# EAGLE design C3D ReMix Expansion - RJ45 Hat (EAGLE 6.4)
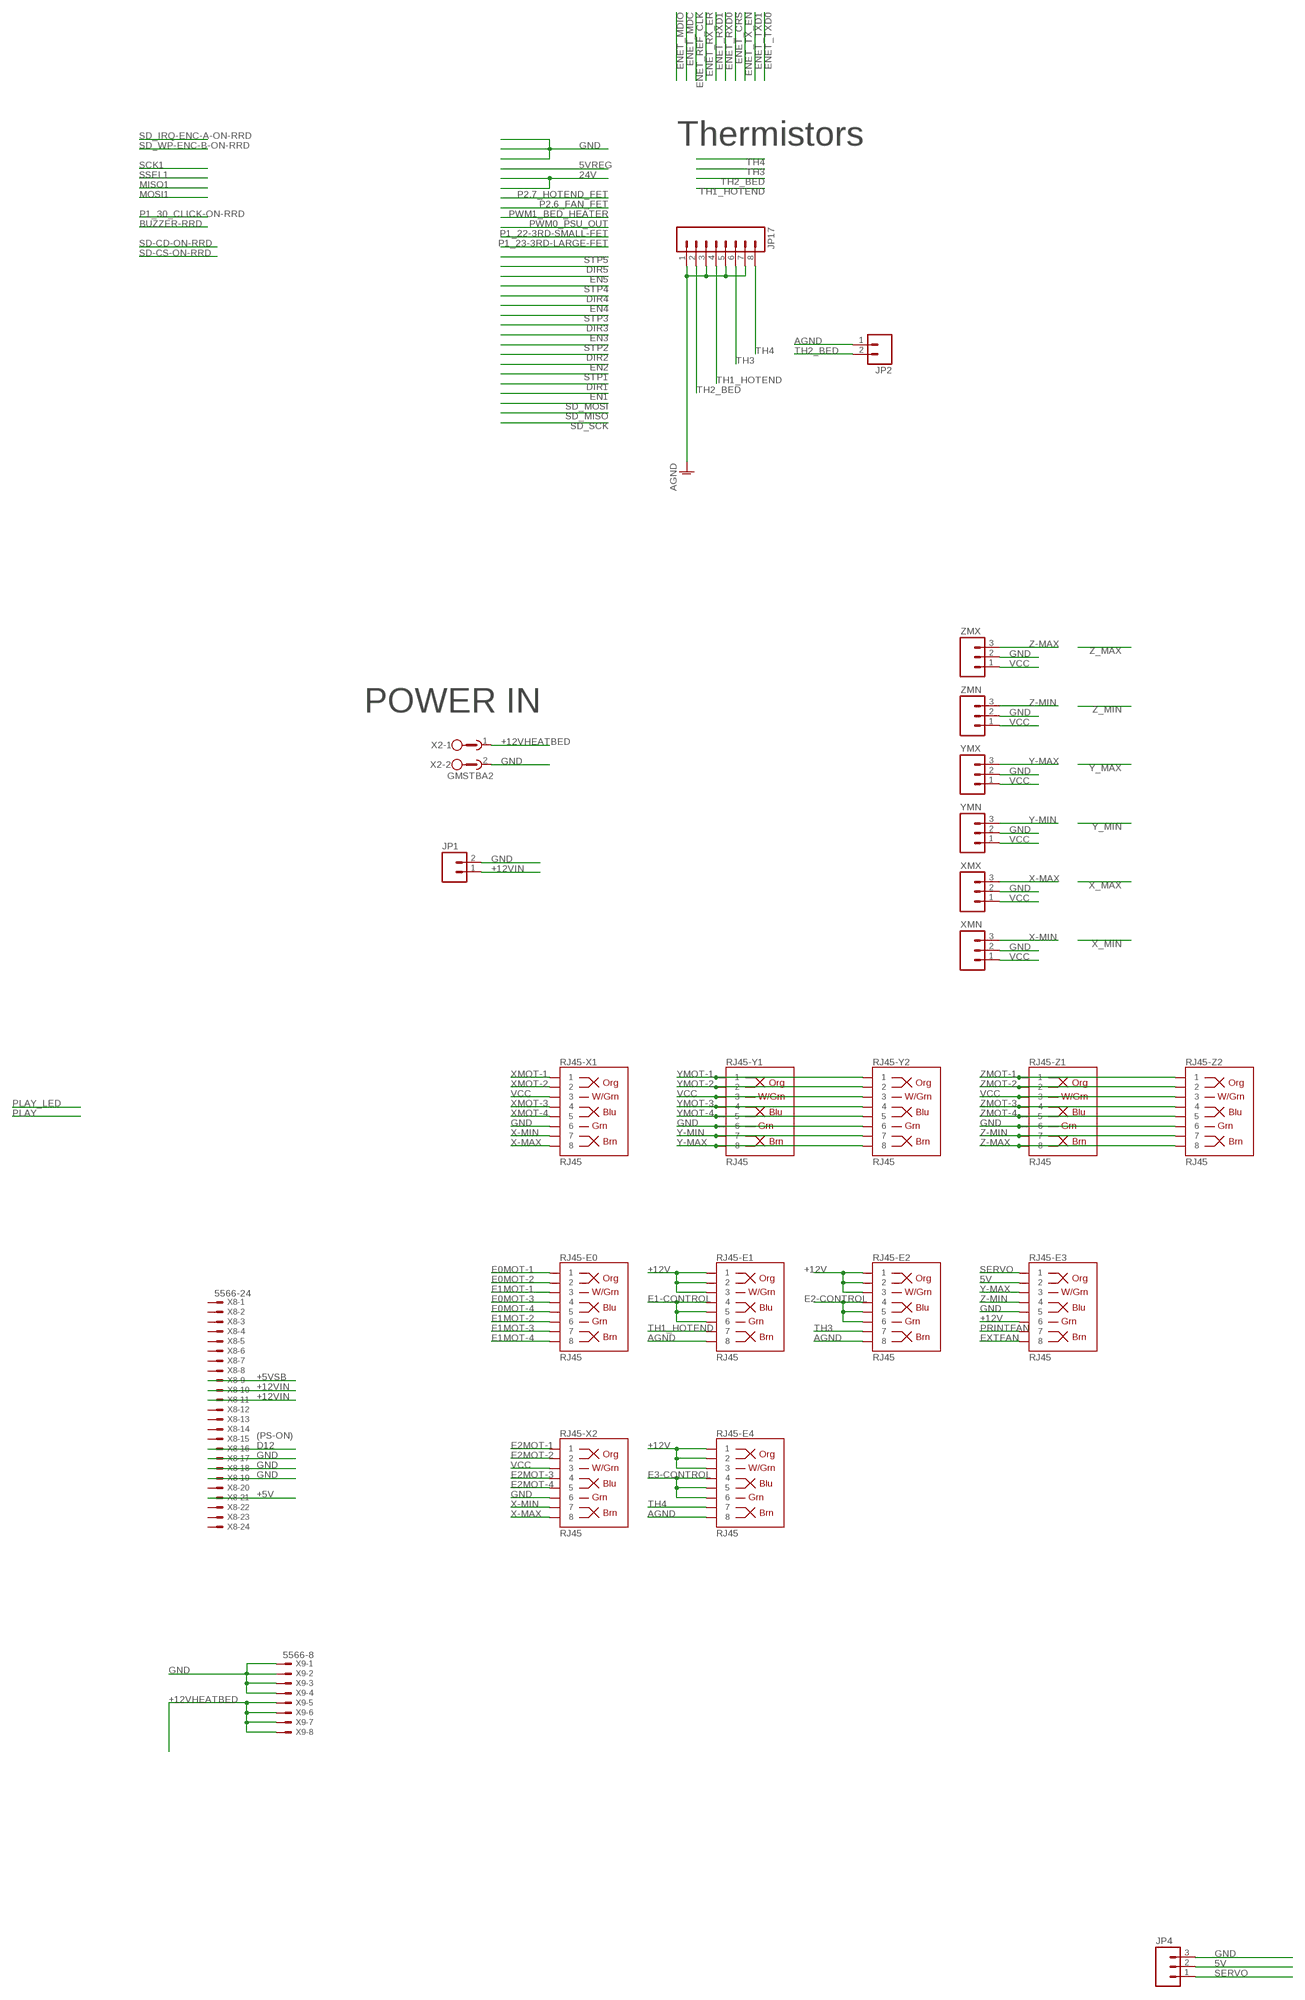
[diagram p0: schematic, sheet 1, part 1 of 2]
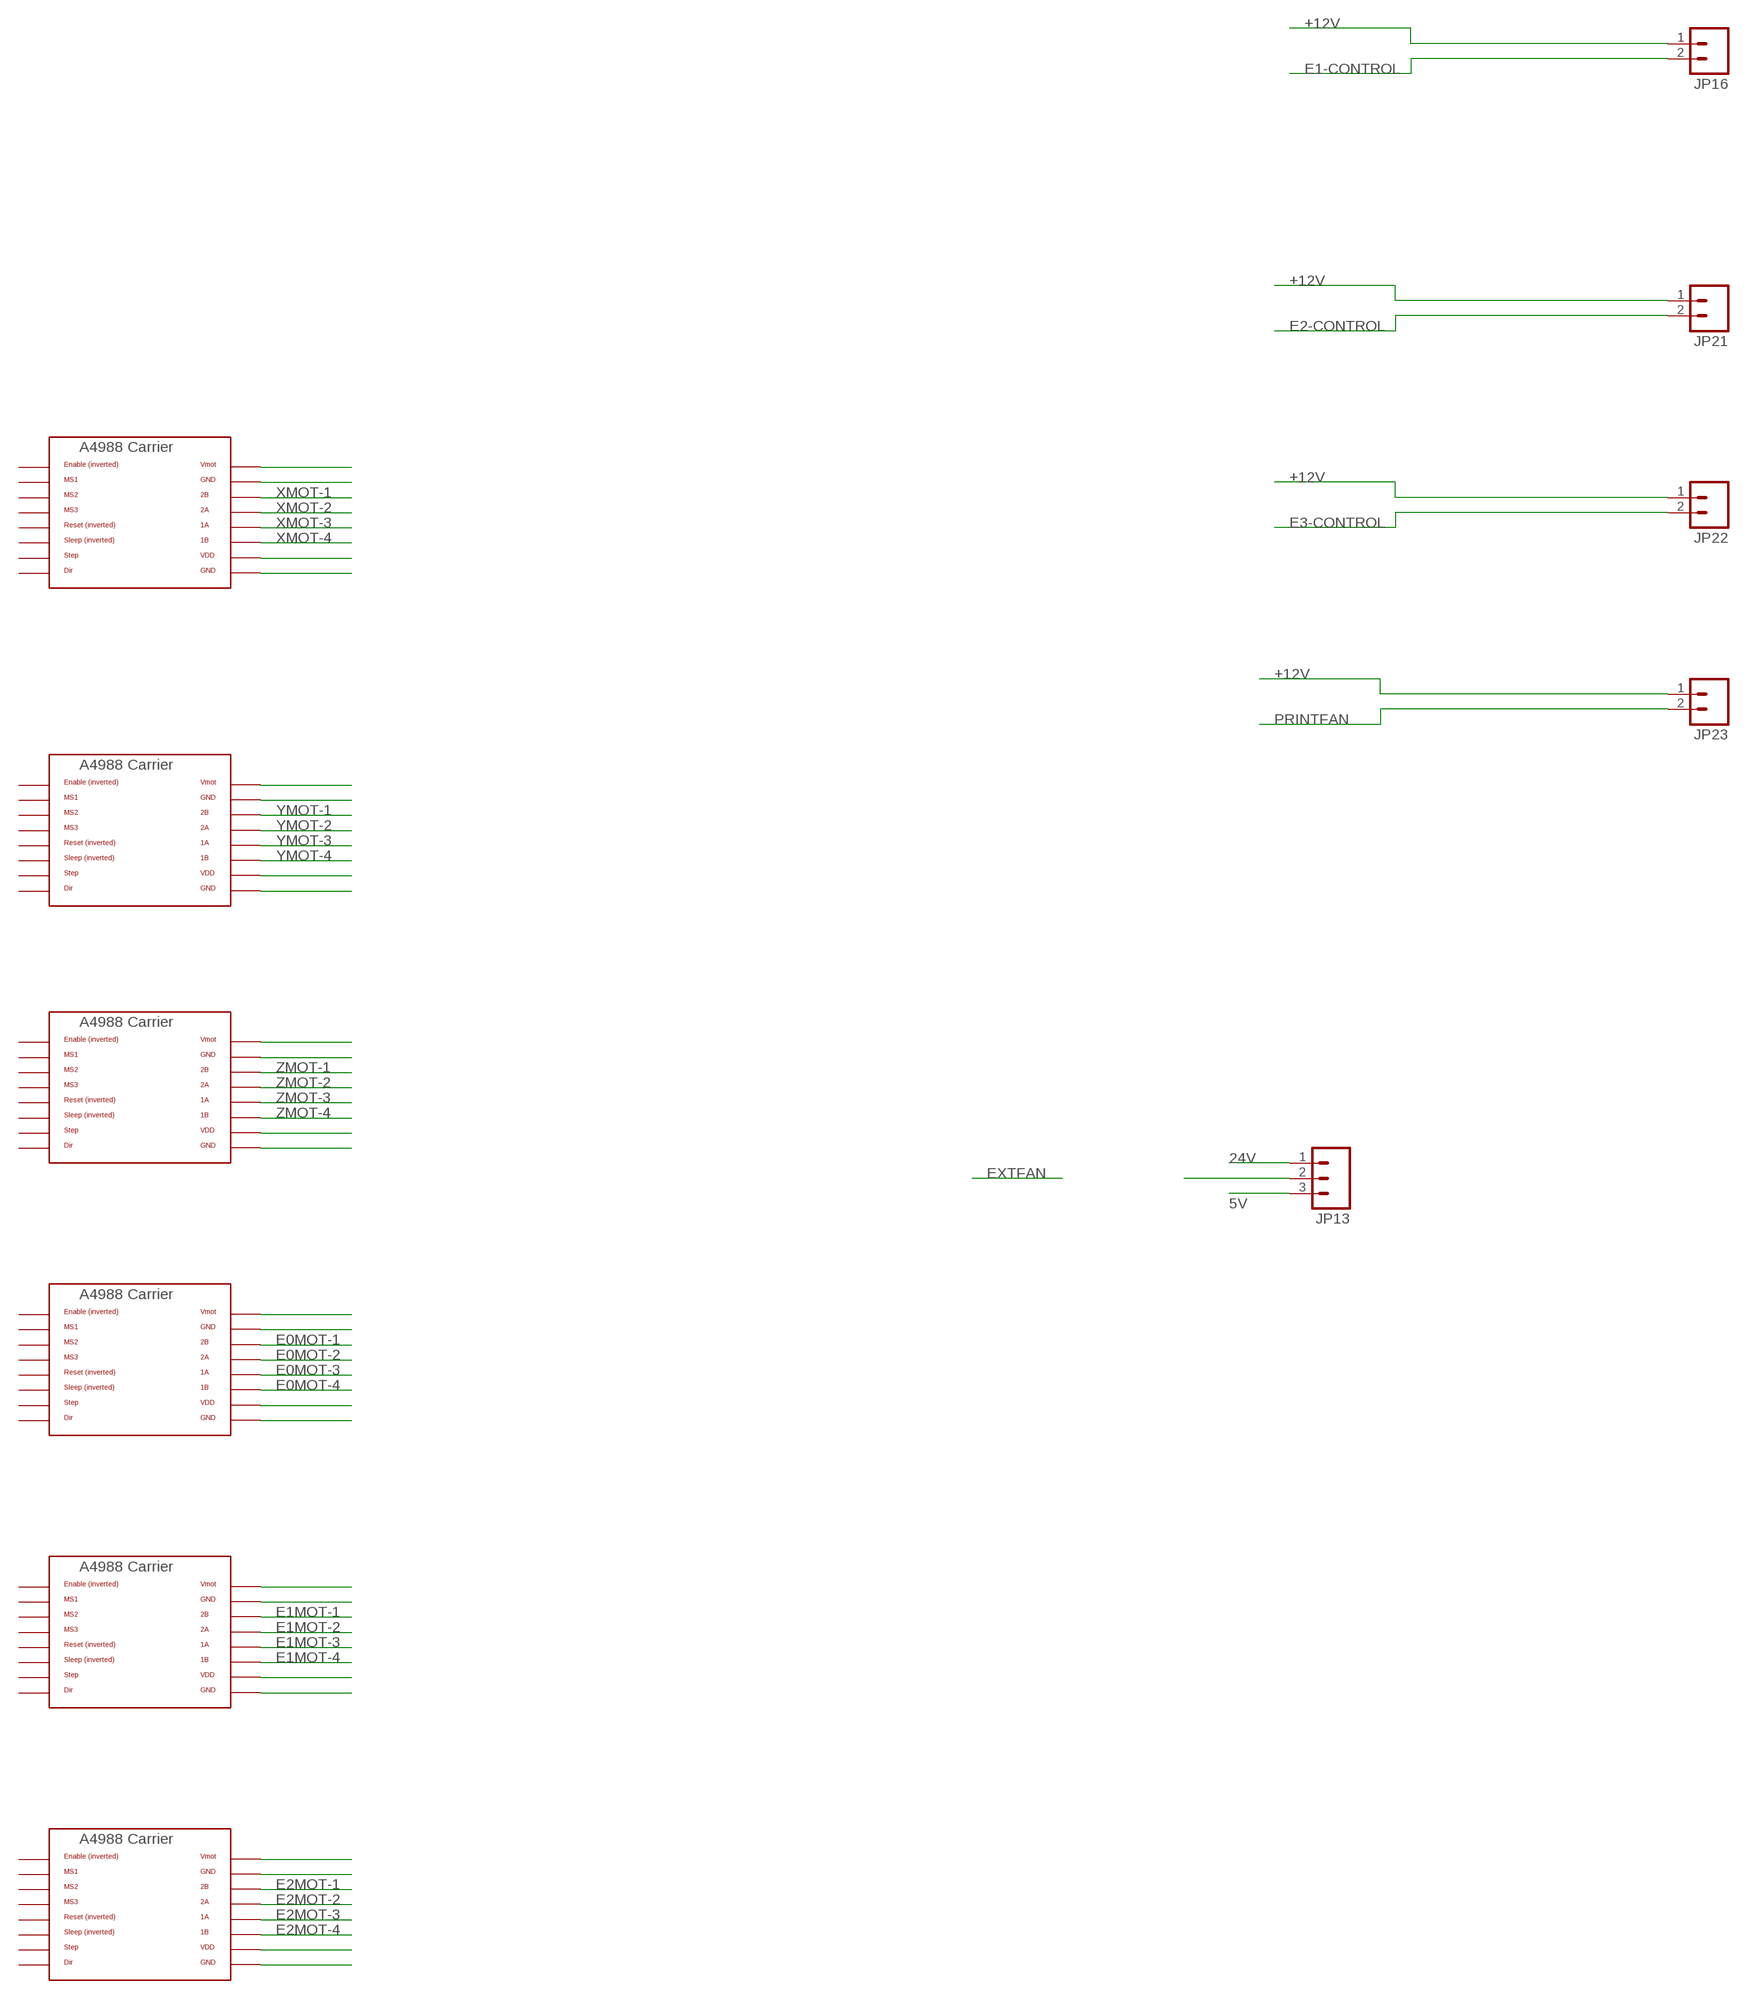
[diagram p1: schematic, sheet 1, part 2 of 2]

## Parts
JP1  M025MM  [SCREWTERMINAL-5MM-2]
JP2  M02LOCK  [1X02_LOCK]
JP4  M03LOCK  [1X03_LOCK]
JP13  M03LOCK_NO_SILK  [1X03_LOCK_NO_SILK]
JP16  M02LOCK  [1X02_LOCK]
JP17  M08LOCK  [1X08_LOCK]
JP21  M02LOCK  [1X02_LOCK]
JP22  M02LOCK  [1X02_LOCK]
JP23  M02LOCK  [1X02_LOCK]
RJ45-E0  RJ45  RJ45-8PTH  [RJ45-8]
RJ45-E1  RJ45  RJ45-8PTH  [RJ45-8]
RJ45-E2  RJ45  RJ45-8PTH  [RJ45-8]
RJ45-E3  RJ45  RJ45-8PTH  [RJ45-8]
RJ45-E4  RJ45  RJ45-8PTH  [RJ45-8]
RJ45-X1  RJ45  RJ45-8PTH  [RJ45-8]
RJ45-X2  RJ45  RJ45-8PTH  [RJ45-8]
RJ45-Y1  RJ45  RJ45-8PTH  [RJ45-8]
RJ45-Y2  RJ45  RJ45-8PTH  [RJ45-8]
RJ45-Z1  RJ45  RJ45-8PTH  [RJ45-8]
RJ45-Z2  RJ45  RJ45-8PTH  [RJ45-8]
U$1  POLOLU_A4983CARRIER  [A4988BREAKOUT]
U$5  POLOLU_A4983CARRIER  [A4988BREAKOUT]
U$6  POLOLU_A4983CARRIER  [A4988BREAKOUT]
U$7  POLOLU_A4983CARRIER  [A4988BREAKOUT]
U$8  POLOLU_A4983CARRIER  [A4988BREAKOUT]
U$9  POLOLU_A4983CARRIER  [A4988BREAKOUT]
X2  GMSTBA2  [GMSTBA2]
X8  5566-24  [5566-24]
X9  5566-8  [5566-8]
XMN  M03POLAR_LOCK  [MOLEX-1X3_LOCK]
XMX  M03POLAR_LOCK  [MOLEX-1X3_LOCK]
YMN  M03POLAR_LOCK  [MOLEX-1X3_LOCK]
YMX  M03POLAR_LOCK  [MOLEX-1X3_LOCK]
ZMN  M03POLAR_LOCK  [MOLEX-1X3_LOCK]
ZMX  M03POLAR_LOCK  [MOLEX-1X3_LOCK]

## Nets
5V: JP4.2 JP13.3 RJ45-E3.2
24V: JP13.1
+5V: X8.21
+5VSB [1-Amp Class]: X8.9
+12V [power]: JP16.1 JP21.1 JP22.1 JP23.1 RJ45-E1.1 RJ45-E1.2 RJ45-E1.3 RJ45-E2.1 RJ45-E2.2 RJ45-E2.3 RJ45-E3.6 RJ45-E4.1 RJ45-E4.2 RJ45-E4.3
+12VHEATBED [30-Amp Class]: X2.1 X9.5 X9.6 X9.7 X9.8
+12VIN [30-Amp Class]: JP1.1 X8.10 X8.11
AGND: JP2.1 JP17.1 JP17.3 JP17.5 JP17.7 RJ45-E1.8 RJ45-E2.8 RJ45-E4.8
D12: X8.16
E0MOT-1 [1-Amp Class]: RJ45-E0.1 U$7.2B
E0MOT-2 [1-Amp Class]: RJ45-E0.2 U$7.2A
E0MOT-3 [1-Amp Class]: RJ45-E0.4 U$7.1A
E0MOT-4 [1-Amp Class]: RJ45-E0.5 U$7.1B
E1-CONTROL [3.3-Amp Class]: JP16.2 RJ45-E1.4 RJ45-E1.5 RJ45-E1.6
E1MOT-1 [1-Amp Class]: RJ45-E0.3 U$8.2B
E1MOT-2 [1-Amp Class]: RJ45-E0.6 U$8.2A
E1MOT-3 [1-Amp Class]: RJ45-E0.7 U$8.1A
E1MOT-4 [1-Amp Class]: RJ45-E0.8 U$8.1B
E2-CONTROL [3.3-Amp Class]: JP21.2 RJ45-E2.4 RJ45-E2.5 RJ45-E2.6
E2MOT-1 [1-Amp Class]: RJ45-X2.1 U$9.2B
E2MOT-2 [1-Amp Class]: RJ45-X2.2 U$9.2A
E2MOT-3 [1-Amp Class]: RJ45-X2.4 U$9.1A
E2MOT-4 [1-Amp Class]: RJ45-X2.5 U$9.1B
E3-CONTROL [3.3-Amp Class]: JP22.2 RJ45-E4.4 RJ45-E4.5 RJ45-E4.6
EXTFAN: RJ45-E3.8
GND: JP1.2 JP4.3 RJ45-E3.5 RJ45-X1.6 RJ45-X2.6 RJ45-Y1.6 RJ45-Y2.6 RJ45-Z1.6 RJ45-Z2.6 X2.2 X8.17 X8.18 X8.19 X9.1 X9.2 X9.3 X9.4 XMN.2 XMX.2 YMN.2 YMX.2 ZMN.2 ZMX.2
N$1: U$1.VMOT
N$2: U$5.VMOT
N$3: U$6.VMOT
N$6: U$7.VMOT
N$8: U$8.VMOT
N$9: U$9.VMOT
N$10: U$8.GND
N$12: U$1.GND
N$14: U$1.GND@0(GND)
N$15: U$5.GND@0(GND)
N$17: U$5.VDD
N$18: U$1.VDD
N$19: U$6.GND
N$20: U$6.VDD
N$21: U$6.GND@0(GND)
N$22: U$7.GND
N$23: U$7.VDD
N$24: U$7.GND@0(GND)
N$25: U$8.VDD
N$26: U$8.GND@0(GND)
N$27: U$9.GND
N$28: U$9.VDD
N$29: U$9.GND@0(GND)
N$30: U$5.GND
N$56: JP13.2
PRINTFAN: JP23.2 RJ45-E3.7
SERVO: JP4.1 RJ45-E3.1
TH1_HOTEND: JP17.4 RJ45-E1.7
TH2_BED: JP2.2 JP17.2
TH3: JP17.6 RJ45-E2.7
TH4: JP17.8 RJ45-E4.7
VCC: RJ45-X1.3 RJ45-X2.3 RJ45-Y1.3 RJ45-Y2.3 RJ45-Z1.3 RJ45-Z2.3 XMN.1 XMX.1 YMN.1 YMX.1 ZMN.1 ZMX.1
X-MAX: RJ45-X1.8 RJ45-X2.8 XMX.3
X-MIN: RJ45-X1.7 RJ45-X2.7 XMN.3
XMOT-1 [1-Amp Class]: RJ45-X1.1 U$1.2B
XMOT-2 [1-Amp Class]: RJ45-X1.2 U$1.2A
XMOT-3 [1-Amp Class]: RJ45-X1.4 U$1.1A
XMOT-4 [1-Amp Class]: RJ45-X1.5 U$1.1B
Y-MAX: RJ45-E3.3 RJ45-Y1.8 RJ45-Y2.8 YMX.3
Y-MIN: RJ45-Y1.7 RJ45-Y2.7 YMN.3
YMOT-1 [1-Amp Class]: RJ45-Y1.1 RJ45-Y2.1 U$5.2B
YMOT-2 [1-Amp Class]: RJ45-Y1.2 RJ45-Y2.2 U$5.2A
YMOT-3 [1-Amp Class]: RJ45-Y1.4 RJ45-Y2.4 U$5.1A
YMOT-4 [1-Amp Class]: RJ45-Y1.5 RJ45-Y2.5 U$5.1B
Z-MAX: RJ45-Z1.8 RJ45-Z2.8 ZMX.3
Z-MIN: RJ45-E3.4 RJ45-Z1.7 RJ45-Z2.7 ZMN.3
ZMOT-1 [1-Amp Class]: RJ45-Z1.1 RJ45-Z2.1 U$6.2B
ZMOT-2 [1-Amp Class]: RJ45-Z1.2 RJ45-Z2.2 U$6.2A
ZMOT-3 [1-Amp Class]: RJ45-Z1.4 RJ45-Z2.4 U$6.1A
ZMOT-4 [1-Amp Class]: RJ45-Z1.5 RJ45-Z2.5 U$6.1B
Unconnected: U$1.DIR U$1.EN U$1.MS1 U$1.MS2 U$1.MS3 U$1.RST U$1.SLP(SLEEP) U$1.STEP U$5.DIR U$5.EN U$5.MS1 U$5.MS2 U$5.MS3 U$5.RST U$5.SLP(SLEEP) U$5.STEP U$6.DIR U$6.EN U$6.MS1 U$6.MS2 U$6.MS3 U$6.RST U$6.SLP(SLEEP) U$6.STEP U$7.DIR U$7.EN U$7.MS1 U$7.MS2 U$7.MS3 U$7.RST U$7.SLP(SLEEP) U$7.STEP U$8.DIR U$8.EN U$8.MS1 U$8.MS2 U$8.MS3 U$8.RST U$8.SLP(SLEEP) U$8.STEP U$9.DIR U$9.EN U$9.MS1 U$9.MS2 U$9.MS3 U$9.RST U$9.SLP(SLEEP) U$9.STEP X8.1 X8.2 X8.3 X8.4 X8.5 X8.6 X8.7 X8.8 X8.12 X8.13 X8.14 X8.15 X8.20 X8.22 X8.23 X8.24

## Notes on the sheet
- Thermistors
- POWER IN
- (PS-ON)

## Library data of the parts
JP1 = SparkFun-Connectors:M02: Standard 2-pin 0.1" header. Use with - straight break away headers ( PRT-00116) - right angle break away headers (PRT-00553) - swiss pins (PRT-00743) - machine pins (PRT-00117) - female headers (PRT-00115) Molex polarized connector foot print use with: PRT-08233 with associated crimp pins and housings. 2.54_SCREWTERM for use with PRT-10571. 3.5mm Screw Terminal footprints for PRT-08084 5mm Screw Terminal footprints for use with PRT-08432; STOREFRONT_ID: PRT-08432
JP2 JP16 JP21-JP23 = SparkFun-Connectors:M02: Standard 2-pin 0.1" header. Use with - straight break away headers ( PRT-00116) - right angle break away headers (PRT-00553) - swiss pins (PRT-00743) - machine pins (PRT-00117) - female headers (PRT-00115) Molex polarized connector foot print use with: PRT-08233 with associated crimp pins and housings. 2.54_SCREWTERM for use with PRT-10571. 3.5mm Screw Terminal footprints for PRT-08084 5mm Screw Terminal footprints for use with PRT-08432
JP4 JP13 XMN XMX YMN YMX ZMN ZMX = SparkFun-Connectors:M03: Header 3 Standard 3-pin 0.1" header. Use with straight break away headers (SKU : PRT-00116), right angle break away headers (PRT-00553), swiss pins (PRT-00743), machine pins (PRT-00117), and female headers (PRT-00115). Molex polarized connector foot print use with SKU : PRT-08232 with associated crimp pins and housings.
JP17 = SparkFun-Connectors:M08: Header 8 Standard 8-pin 0.1" header. Use with straight break away headers (SKU : PRT-00116), right angle break away headers (PRT-00553), swiss pins (PRT-00743), machine pins (PRT-00117), and female headers (PRT-00115).
RJ45-E0 RJ45-E1-RJ45-E4 RJ45-X1 RJ45-X2 RJ45-Y1 RJ45-Y2 RJ45-Z1 RJ45-Z2 = SparkFun-Connectors:RJ45-8: RJ45 Jack Simple RJ45, 8-pin connection - connector for common Cat5, Cat5e, and Cat6 Ethernet cables. Footprint not yet proven in production. Connector sku is PRT-00643; Breakout PCB sku is BOB-00716.; PROD_ID: CONN-08506
U$1 U$5-U$9 = RepRapjr:POLOLU_A4983CARRIER
X2 = con-phoenix-762:GMSTBA2: PHOENIX; MF: FARNELL; MPN: 1757242; OC_FARNELL: 3705171; OC_NEWARK: 71C4161
X8 = con-molex:5566-24: Mini FIT connector 24 pol Source: http://www.molex.com; OC_FARNELL: unknown; OC_NEWARK: unknown
X9 = con-molex:5566-8: Mini FIT connector 8 pol Source: http://www.molex.com; OC_FARNELL: unknown; OC_NEWARK: unknown

## Net classes
1 power: width 0.6 mm, clearance 0.305 mm
2 ground: width 0.254 mm
3 1-Amp Class: width 0.406 mm
4 30-Amp Class: width 2.54 mm
5 3.3-Amp Class: width 1.27 mm

## Board
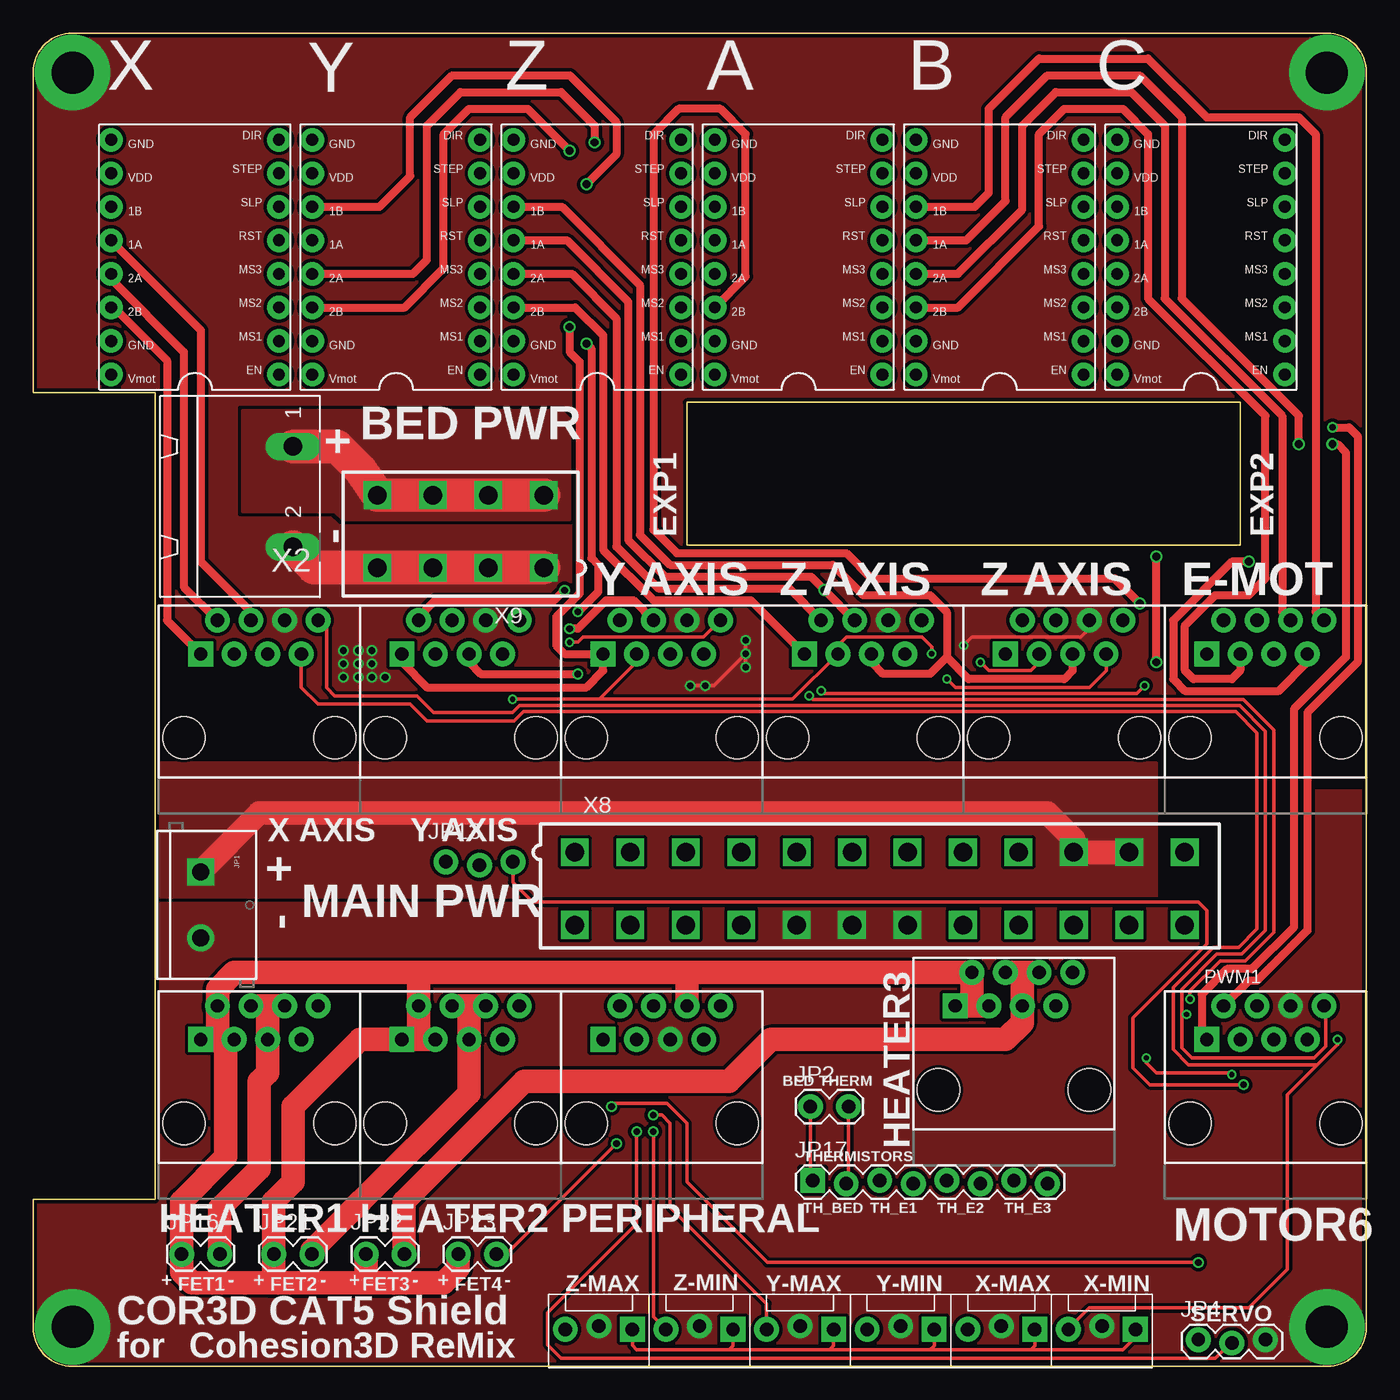
[diagram p2: board, top side]
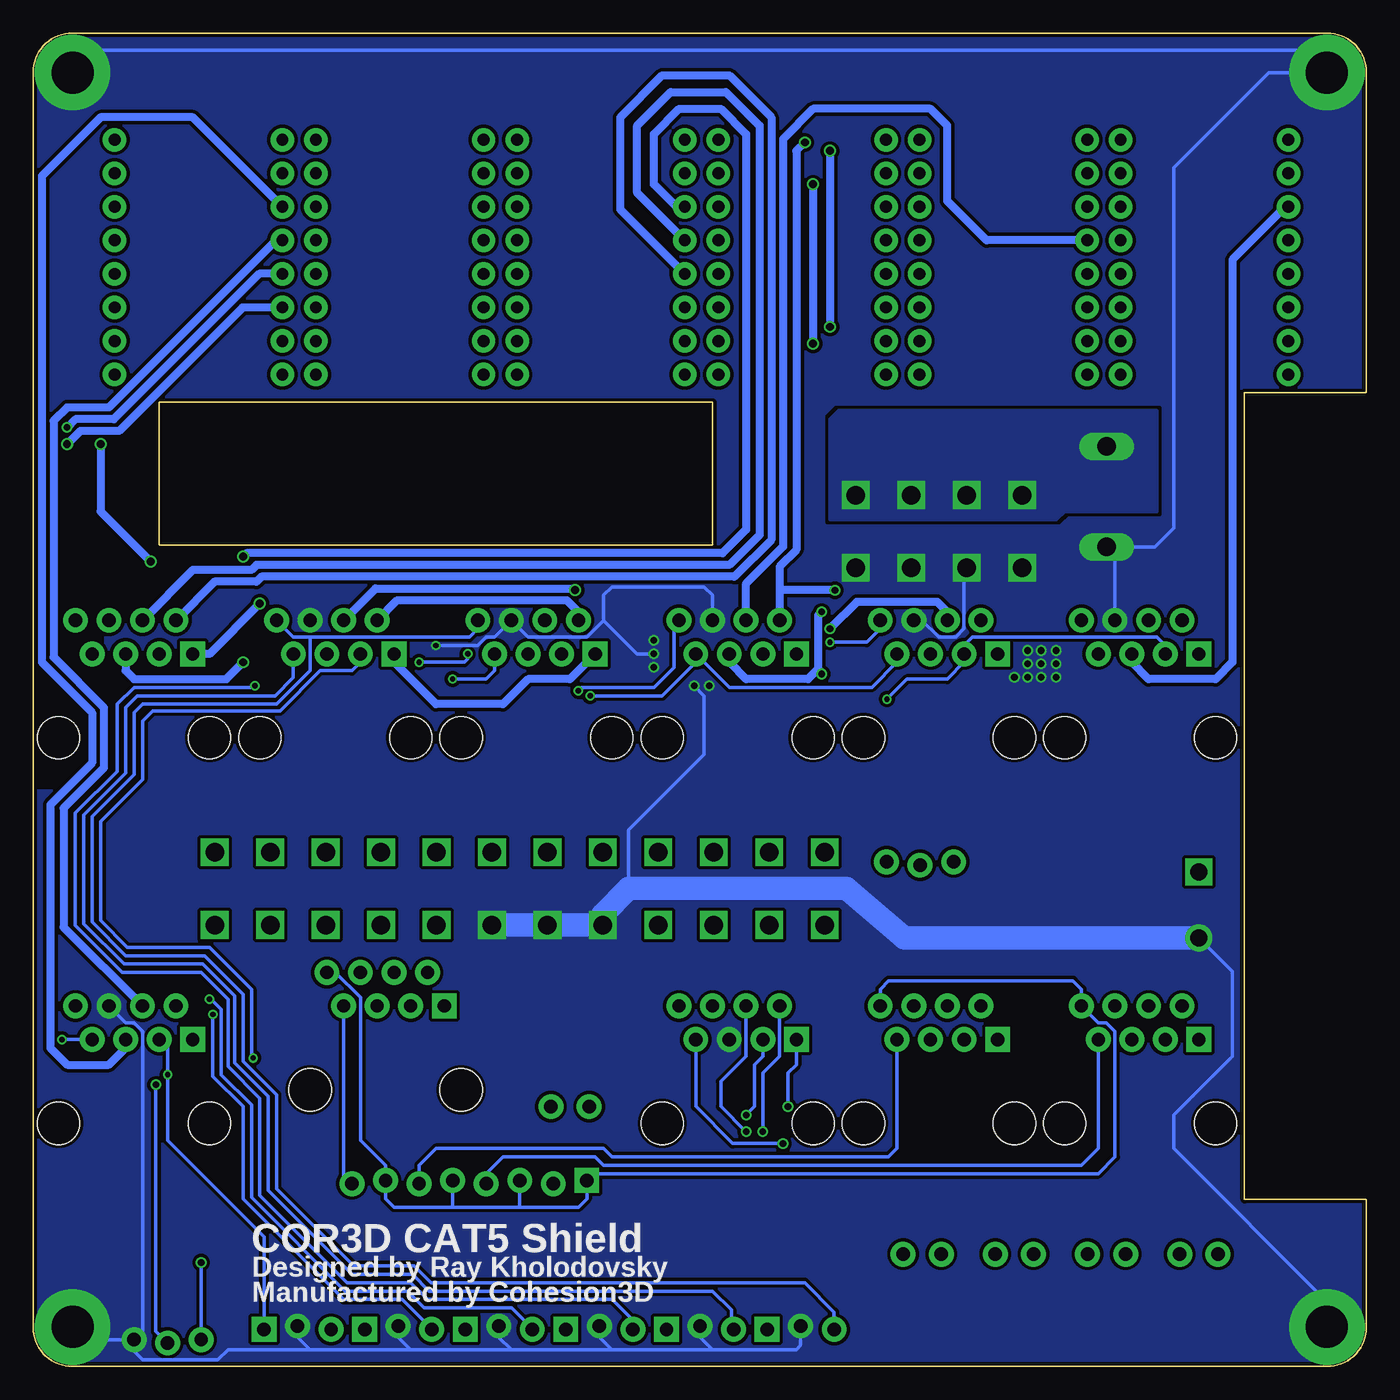
[diagram p3: board, bottom side, seen from below]

Size 101 x 101 mm. Coordinates in mm from the lower left corner, seen from the top.
Outline: 3,0 98,0 arc90 101,3 101,98 arc90 98,101 3,101 arc90 0,98 0,73.75 9.25,73.75 9.25,12.64 0,12.64 0,3 arc90 3,0
Outline: 49.53,73.03 49.53,62.23 91.44,62.23 91.44,73.03 49.53,73.03
Copper layers (1*16): Top 0.035mm / dielectric 1.5mm / Bottom 0.035mm
Design rules "dirt_cheap_dirty_boards.v1 *": minimum track width 10mil, minimum drill 12mil, track to track 8mil, track to pad 6mil, pad to pad 6mil, via to via 6mil, smd to smd 0mil, copper to edge 10mil, drill to drill 10mil, minimum pad ring 10mil, minimum via ring 6mil, stop-mask expansion 2mil, vias tented up to drill 25mil, thermal gap 10mil
tRestrict: area 95.9,44 to 101,62.4
bRestrict: area 95.9,44 to 101,62.4

### Footprints (pad centres in the part's own frame; a part is rotated, then mirrored left to right if it is on the bottom)
SCREWTERMINAL-5MM-2 = drill 1.3 pad 2.032 square: 1 0,0 | drill 1.3 pad 2.032: 2 5,0
1X02_LOCK = drill 1.016 pad 1.88: 1 -0.178,0; 2 2.718,0
1X03_LOCK = drill 1.016 pad 1.88: 1 0,0.127; 2 2.54,-0.127; 3 5.08,0.127
1X03_LOCK_NO_SILK = drill 1.016 pad 1.88: 1 0,0.127; 2 2.54,-0.127; 3 5.08,0.127
1X08_LOCK = drill 1.016 pad 1.88 square: 1 0,0.127 | drill 1.016 pad 1.88: 2 2.54,-0.127; 3 5.08,0.127; 4 7.62,-0.127; 5 10.16,0.127; 6 12.7,-0.127; 7 15.24,0.127; 8 17.78,-0.127
RJ45-8 = drill 1 pad 1.88 square: 1 -4.445,6.35 | drill 1 pad 1.88: 2 -3.175,8.89; 3 -1.905,6.35; 4 -0.635,8.89; 5 0.635,6.35; 6 1.905,8.89; 7 3.175,6.35; 8 4.445,8.89 | hole 3.2: -5.715,0; 5.715,0
A4988BREAKOUT = drill 0.9 pad 1.778: 1A 8.89,1.27; 1B 11.43,1.27; 2A 6.35,1.27; 2B 3.81,1.27; DIR 16.51,-11.43; EN -1.27,-11.43; GND 16.51,1.27; GND@0 1.27,1.27; MS1 1.27,-11.43; MS2 3.81,-11.43; MS3 6.35,-11.43; RST 8.89,-11.43; SLP 11.43,-11.43; STEP 13.97,-11.43; VDD 13.97,1.27; VMOT -1.27,1.27
GMSTBA2 = drill 1.397 long: 1 -3.81,5.08; 2 3.81,5.08
5566-24 = drill 1.4 square: 1 23.1,-2.75; 2 18.9,-2.75; 3 14.7,-2.75; 4 10.5,-2.75; 5 6.3,-2.75; 6 2.1,-2.75; 7 -2.1,-2.75; 8 -6.3,-2.75; 9 -10.5,-2.75; 10 -14.7,-2.75; 11 -18.9,-2.75; 12 -23.1,-2.75; 13 23.1,2.75; 14 18.9,2.75; 15 14.7,2.75; 16 10.5,2.75; 17 6.3,2.75; 18 2.1,2.75; 19 -2.1,2.75; 20 -6.3,2.75; 21 -10.5,2.75; 22 -14.7,2.75; 23 -18.9,2.75; 24 -23.1,2.75
5566-8 = drill 1.4 square: 1 6.3,-2.75; 2 2.1,-2.75; 3 -2.1,-2.75; 4 -6.3,-2.75; 5 6.3,2.75; 6 2.1,2.75; 7 -2.1,2.75; 8 -6.3,2.75
MOLEX-1X3_LOCK = drill 1.016 pad 1.88 square: 1 0,0.127 | drill 1.016 pad 1.88: 2 2.54,-0.127; 3 5.08,0.127

### Placement (x,y rotation side)
JP1  12.7,37.47 270 top
JP2  59.05,19.68 0 top
JP4  88.27,1.91 0 top
JP13  31.27,38.1 0 top
JP16  11.43,8.51 0 top
JP17  59.05,13.97 0 top
JP21  18.41,8.51 0 top
JP22  25.4,8.51 0 top
JP23  32.38,8.51 0 top
RJ45-E0  93.34,47.62 0 top
RJ45-E1  17.14,18.41 0 top
RJ45-E2  32.38,18.41 0 top
RJ45-E3  47.62,18.41 0 top
RJ45-E4  74.3,20.95 0 top
RJ45-X1  17.14,47.62 0 top
RJ45-X2  93.34,18.41 0 top
RJ45-Y1  32.38,47.62 0 top
RJ45-Y2  47.62,47.62 0 top
RJ45-Z1  62.87,47.62 0 top
RJ45-Z2  78.11,47.62 0 top
U$1  7.19,76.41 90 top
U$5  22.42,76.41 90 top
U$6  37.66,76.41 90 top
U$7  52.9,76.41 90 top
U$8  68.14,76.41 90 top
U$9  83.38,76.41 90 top
X2  14.61,65.88 270 top
X8  64.14,36.2 180 top
X9  32.38,63.25 0 top
XMN  83.5,2.94 180 top
XMX  75.88,2.94 180 top
YMN  68.26,2.94 180 top
YMX  60.64,2.94 180 top
ZMN  53.02,2.94 180 top
ZMX  45.4,2.94 180 top

### Tracks (layer width: path | path; a pad name or v marks a point on that pad's centre or on a via)
5V  (via drill 0.5)
  Top 0.254: JP4.2 90.68,1.78 89.53,0.64 40.01,0.64 38.99,1.65 38.99,4.06 45.72,10.79 v45.72,17.78 | JP13.3 36.35,36.67 37.85,35.18 88.27,35.18 88.9,34.54 88.9,32 83.31,26.42 83.31,22.61 84.58,21.34 v91.69,21.34
  Bottom 0.254: v91.69,21.34 91.69,2.67 JP4.2 | RJ45-E3.2 44.45,23.5 45.72,22.23 v45.72,17.78
+12V
  Top 1.778: 29.21,24.77 RJ45-E2.1 24.77,24.77 19.68,19.68 19.68,13.97 18.24,12.52 JP21.1 18.24,6.81 17.78,6.35 | 29.21,24.77 RJ45-E2.3 | 29.21,24.77 RJ45-E2.2 29.21,29.84 | RJ45-E1.1 13.97,24.77 | 13.97,24.77 RJ45-E1.3 | 13.97,24.77 RJ45-E1.2 13.97,28.57 15.24,29.84 29.21,29.84 | 13.97,24.77 14.61,24.13 14.61,15.88 11.25,12.52 JP16.1 11.25,7.16 12.06,6.35 17.78,6.35 | RJ45-E4.1 71.12,27.3 | 71.12,27.3 RJ45-E4.3 | 71.12,27.3 RJ45-E4.2 49.53,29.84 | 29.21,29.84 49.53,29.84 | RJ45-E3.6 49.53,29.84 | 17.78,6.35 25.4,6.35 | 25.4,6.35 31.11,6.35 32.21,7.44 JP23.1 | JP22.1 25.22,6.53 25.4,6.35
+12VHEATBED
  Top 2.54: X9.5 X9.6 X9.7 X9.8 24.82,67.89 23.02,69.69 X2.1
  pour Top (isolate 0.254, no thermals): 15.88,72.39 15.88,64.77 22.86,64.77 23.5,64.14 40.64,64.14 40.64,71.75 40.01,72.39
  pour Bottom (isolate 0.254, no thermals): 15.88,72.39 15.88,64.77 22.86,64.77 23.5,64.14 40.64,64.14 40.64,71.75 40.01,72.39
+12VIN
  Top 1.778: X8.11 X8.10 78.83,39.91 76.83,41.91 17.14,41.91 JP1.1
  pour Top (isolate 0.254, rank 2, no thermals): 9.53,35.56 85.09,35.56 85.09,45.72 9.53,45.72
AGND
  Top 0.254: JP2.1 58.88,14.28 JP17.1
  Bottom 0.254: RJ45-E2.8 36.83,28.57 36.2,29.21 22.23,29.21 21.59,28.57 RJ45-E1.8 20.32,26.04 19.68,26.04 19.05,25.4 19.05,15.88 20.32,14.61 58.55,14.61 JP17.1 59.05,12.7 59.69,12.06 64.14,12.06 | RJ45-E4.8 78.11,29.84 76.2,27.94 76.2,17.14 74.3,15.24 JP17.7 74.3,12.7 73.66,12.06 69.22,12.06 | 64.14,12.06 JP17.3 | 64.14,12.06 69.22,12.06 | 69.22,12.06 JP17.5
E0MOT-1  (via drill 0.6)
  Top 0.61: U$7.2B 53.98,82.55 53.98,93.34 52.07,95.25 48.9,95.25 46.99,93.34 46.99,63.37 48.77,61.59 61.59,61.59 63.5,59.69 81.92,59.69 v83.82,57.78
  Bottom 0.61: RJ45-E0.1 87.63,53.98 v83.82,57.78
E0MOT-2
  Bottom 0.61: U$7.2A 56.52,87.63 56.52,94.61 53.34,97.79 48.26,97.79 45.09,94.61 45.09,62.61 47.88,59.82 83.69,59.82 84.07,59.44 87.25,59.44 RJ45-E0.2
E0MOT-3
  Bottom 0.61: U$7.1A 55.24,88.9 55.24,93.98 52.7,96.52 48.51,96.52 45.97,93.98 45.97,62.99 48.26,60.71 84.07,60.71 84.45,60.33 88.9,60.33 RJ45-E0.4
E0MOT-4  (via drill 0.6)
  Top 0.61: v85.09,53.34 v85.09,61.34
  Bottom 0.61: U$7.1B 52.28,87.84 53.98,89.53 53.98,93.34 52.07,95.25 48.9,95.25 46.99,93.34 46.99,63.37 48.77,61.59 84.84,61.59 v85.09,61.34 | RJ45-E0.5 93.98,52.7 93.34,52.07 86.36,52.07 v85.09,53.34
E1-CONTROL
  Top 1.778: RJ45-E1.4 17.78,27.3 | 17.78,27.3 RJ45-E1.6 | 17.78,27.3 RJ45-E1.5 17.78,22.23 17.14,21.59 17.14,14.99 14.15,11.99 JP16.2
E1MOT-1
  Top 0.61: U$8.2B 70.06,80.22 76.2,86.36 76.2,93.34 78.11,95.25 82.55,95.25 84.45,93.34 84.45,80.9 93.34,72.01 93.34,59.69 92.08,58.42 89.53,58.42 87.25,56.13 87.25,52.7 87.88,52.07 90.81,52.07 91.44,52.7 RJ45-E0.3
E1MOT-2
  Top 0.61: U$8.2A 70.06,82.76 74.93,87.63 74.93,93.98 77.47,96.52 83.19,96.52 85.72,93.98 85.72,80.9 94.61,72.01 94.61,57.15 RJ45-E0.6
E1MOT-3  (via drill 0.6)
  Top 0.61: U$8.1A 70.69,85.3 73.66,88.27 73.66,94.61 76.83,97.79 83.82,97.79 87,94.61 87,80.9 95.89,72.01 v95.89,69.85 | v92.08,60.96 90.81,60.96 86.36,56.52 86.36,52.07 87.25,51.18 94.36,51.18 96.52,53.34 RJ45-E0.7
  Bottom 0.61: v92.08,60.96 95.89,64.77 v95.89,69.85
E1MOT-4
  Top 0.61: U$8.1B 71.33,87.84 72.39,88.9 72.39,95.25 76.2,99.06 84.45,99.06 88.9,94.61 95.89,94.61 97.16,93.34 97.16,57.15 RJ45-E0.8
E2-CONTROL
  Top 1.778: RJ45-E2.4 33.02,27.3 | 33.02,27.3 RJ45-E2.6 | 33.02,27.3 RJ45-E2.5 33.02,20.7 24.89,12.57 23.98,11.66 21.13,8.81 JP21.2
E2MOT-1  (via drill 0.6)
  Top 0.61: v98.42,69.85 98.81,69.85 99.44,69.22 99.44,53.72 95.5,49.78 95.5,33.27 92.33,30.1 90.42,30.1 88.52,28.19 88.52,25.15 RJ45-X2.1
  Bottom 0.61: U$9.2B 85.14,80.22 94.49,70.87 97.41,70.87 v98.42,69.85
E2MOT-2  (via drill 0.5)
  Top 0.61: v98.42,71.12 99.69,71.12 100.33,70.48 100.33,53.34 96.52,49.53 96.52,33.02 92.71,29.21 92.08,29.21 RJ45-X2.2
  Bottom 0.61: U$9.2A 83.87,82.76 94.87,71.75 97.79,71.75 v98.42,71.12
E2MOT-3
  Bottom 0.61: U$9.1A 82.6,85.3 95.25,72.64 98.42,72.64 99.44,71.63 99.44,53.72 95.63,49.91 95.63,45.34 98.68,42.29 98.68,33.27 RJ45-X2.4
E2MOT-4
  Bottom 0.61: U$9.1B 88.9,94.61 95.89,94.61 100.33,90.17 100.33,53.34 96.52,49.53 96.52,45.72 99.69,42.55 99.69,24.13 98.42,22.86 95.25,22.86 93.98,24.13 RJ45-X2.5
E3-CONTROL
  Top 1.778: RJ45-E4.4 74.93,29.84 | 74.93,29.84 RJ45-E4.6 | 74.93,29.84 RJ45-E4.5 74.93,26.04 73.66,24.77 55.88,24.77 52.7,21.59 37.21,21.59 28.12,12.5 JP22.2
GND  (via drill 0.4, 0.5, 3.2 pad 5.71)
  Top 0.254: RJ45-Z2.6 80.01,55.88 79.38,55.24 71.12,55.24 v70.48,54.61 | v53.98,53.98 51.56,51.56 v50.93,51.56 v49.78,51.56 | v53.98,52.96 v53.98,53.98 | v53.98,54.99 v53.98,53.98
  Top 2.54: X9.1 X9.2 X9.3 X9.4 21.26,60.5 X2.2
  Bottom 0.254: ZMX.2 42.86,1.59 43.18,1.27 49.53,1.27 | 80.01,1.27 86.23,1.27 87,0.51 92.71,0.51 93.34,1.14 JP4.3 | 80.01,1.27 72.39,1.27 | 72.39,1.27 64.77,1.27 | 64.77,1.27 57.15,1.27 | 57.15,1.27 49.53,1.27 | JP4.3 93.22,2.03 | JP4.3 97.03,2.03 v98,3 | RJ45-Y1.6 33.66,56.52 32.38,55.24 31.11,55.24 30.48,55.88 30.48,60.33 X9.3 | 57.78,56.52 59.05,55.24 63.5,55.24 RJ45-Z1.6 66.04,55.24 66.67,55.24 67.31,54.61 v70.48,54.61 | 57.78,56.52 57.78,58.42 57.15,59.05 50.16,59.05 49.53,58.42 RJ45-Y2.6 | RJ45-X2.6 93.98,26.04 93.34,26.04 92.71,25.4 92.71,2.67 JP4.3 | RJ45-X1.6 19.05,61.44 X2.2 16.03,62.07 14.61,63.5 14.61,90.81 7.41,98 v3,98 4.7,99.69 96.52,99.69 98,98.22 v98,98 | v3,3 3,4.91 14.61,16.51 14.61,19.05 10.16,23.5 10.16,29.93 JP1.2 | 55.88,36.2 55.88,40.64 50.16,46.35 50.16,50.8 v50.93,51.56 | 57.78,56.52 55.24,53.98 v53.98,53.98 | ZMN.2 50.48,2.22 49.53,1.27 | YMX.2 58.1,2.22 57.15,1.27 | YMN.2 65.72,2.22 64.77,1.27 | XMX.2 73.34,2.22 72.39,1.27 | XMN.2 80.96,2.22 80.01,1.27
  Bottom 1.778: JP1.2 35.01,32.47 39.37,36.2 55.88,36.2 57.84,34.24 X8.17 X8.18 X8.19
  other vias: 25.65,52.2 24.64,52.2 23.5,52.2 26.67,52.2 23.5,53.21 24.64,53.21 25.65,53.21 23.5,54.23 24.64,54.23 25.65,54.23
  pour Bottom (isolate 0.254, rank 5, no thermals): 0,0 101.6,0 101.6,101.6 0,101.6
  pour Top (isolate 0.254, rank 5, no thermals): 0,0 101.6,0 101.6,101.6 0,101.6
PRINTFAN  (via drill 0.5)
  Top 0.254: v44.2,16.89 35.81,8.51 JP23.2
  Bottom 0.254: RJ45-E3.7 50.8,19.68 48.01,16.89 v44.2,16.89
SERVO  (via drill 0.5)
  Top 0.254: v88.27,7.87 55.63,7.87 49.53,13.97 49.53,18.41 48.01,19.94 44.07,19.94 v43.81,19.68
  Bottom 0.254: RJ45-E3.1 43.18,22.86 43.81,22.23 v43.81,19.68 | v88.27,7.87 JP4.1
TH1_HOTEND
  Bottom 0.254: RJ45-E1.7 20.32,16.51 21.59,15.24 57.78,15.24 58.42,15.88 65.41,15.88 66.67,14.61 JP17.4
TH2_BED
  Top 0.254: JP2.2 61.77,14.02 JP17.2
TH3
  Bottom 0.254: RJ45-E2.7 35.56,16.51 36.2,15.88 57.15,15.88 57.78,16.51 70.48,16.51 71.75,15.24 JP17.6
TH4
  Bottom 0.254: RJ45-E4.7 77.47,14.48 JP17.8
VCC  (via drill 0.4)
  Top 0.254: ZMX.1 45.4,1.59 45.72,1.27 52.7,1.27 | 75.56,1.27 82.55,1.27 83.5,2.22 XMN.1 | 75.56,1.27 67.94,1.27 | 67.94,1.27 60.33,1.27 | 60.33,1.27 52.7,1.27 | v36.32,50.55 42.93,50.55 | 42.93,50.55 45.72,53.34 RJ45-Y2.3 | 42.93,50.55 57.53,50.55 RJ45-Z1.3 60.96,54.61 61.59,55.24 67.31,55.24 68.07,54.48 v68.07,53.98 | RJ45-Z2.3 76.2,53.34 75.56,52.7 72.39,52.7 v71.75,53.34 | v84.33,23.37 84.33,22.99 85.09,22.23 90.68,22.23 v90.81,22.1 | ZMN.1 53.02,1.58 52.7,1.27 | YMX.1 60.64,1.58 60.33,1.27 | YMN.1 68.26,1.58 67.94,1.27 | XMX.1 75.88,1.58 75.56,1.27
  Bottom 0.254: v36.32,50.55 34.8,52.07 31.75,52.07 30.48,53.34 RJ45-Y1.3 30.48,54.61 29.84,55.24 15.88,55.24 15.24,54.61 RJ45-X1.3 | v71.75,53.34 68.33,53.34 68.07,53.59 v68.07,53.98 | RJ45-Z2.3 76.2,53.34 76.83,52.7 79.25,52.7 82.3,49.66 91.95,49.66 92.71,48.9 92.71,44.45 95.89,41.27 95.89,33.78 93.85,31.75 87.63,31.75 84.45,28.57 84.45,23.5 v84.33,23.37 | RJ45-X2.3 90.81,24.13 v90.81,22.1 90.81,17.14 83.5,9.84 XMN.1
X-MAX  (via drill 0.4)
  Top 0.254: RJ45-X1.8 22.23,55.88 22.23,51.44 22.86,50.8 29.08,50.8 30.35,49.53 36.32,49.53 36.85,50.06 91.39,50.06 93.34,48.11 93.34,33.02 91.57,31.24 89.66,31.24 87,28.57 87,26.67 | 87,26.67 87,24.13 87.76,23.37 97.03,23.37 97.92,24.26 97.92,27.18 RJ45-X2.8 | 87,26.67 v87.38,26.67
  Bottom 0.254: v87.38,26.67 87.38,21.97 85.09,19.68 85.09,12.7 77.47,5.08 73.03,5.08 70.8,2.85 XMX.3
X-MIN  (via drill 0.4)
  Top 0.254: RJ45-X1.7 20.32,51.44 21.59,50.16 28.57,50.16 29.84,48.9 36.45,48.9 37.16,49.61 91.08,49.61 92.71,47.98 92.71,33.15 91.31,31.75 89.41,31.75 86.36,28.7 86.36,24 87.5,22.86 97.28,22.86 | 97.28,22.86 98.81,24.38 v98.81,24.77 | 97.28,22.86 95,20.57 95,7.37 92.08,4.45 80.01,4.45 78.42,2.85 XMN.3
  Bottom 0.254: v98.81,24.77 RJ45-X2.7
XMOT-1
  Top 0.61: U$1.2B 6.14,80.22 10.16,76.2 10.16,56.52 RJ45-X1.1
XMOT-2
  Top 0.61: U$1.2A 5.92,82.34 11.43,76.83 11.43,59.05 RJ45-X1.2
XMOT-3
  Top 0.61: RJ45-X1.4 16.51,57.15 12.7,60.96 12.7,78.49 5.92,85.27 U$1.1A
XMOT-4
  Bottom 0.61: U$1.1B 6.14,87.84 10.16,83.82 10.16,53.34 11.43,52.07 16.51,52.07 17.78,53.34 RJ45-X1.5
Y-MAX  (via drill 0.4, 0.5)
  Top 0.254: RJ45-Y2.8 50.8,55.24 41.66,55.24 41.27,54.86 v40.64,54.86 | v84.2,51.56 83.62,50.98 59.89,50.98 v59.69,51.18 | v46.99,19.05 47.62,19.05 48.26,18.41 48.26,12.06 55.56,4.76 YMX.3
  Bottom 0.254: RJ45-Y1.8 36.83,55.88 37.85,54.86 v40.64,54.86 | RJ45-Y2.8 52.45,56.13 52.45,52.96 53.98,51.44 59.44,51.44 v59.69,51.18 | v84.2,51.56 84.33,51.44 93.34,51.44 94.61,50.16 94.61,45.09 97.79,41.91 97.79,33.4 94.23,29.84 88.27,29.84 86.23,27.81 86.23,22.73 83.82,20.32 83.82,12.95 77.22,6.35 72.39,6.35 71.12,5.08 57.15,5.08 55.56,3.49 YMX.3 | RJ45-E3.3 45.72,23.5 46.35,22.86 46.35,19.68 v46.99,19.05
Y-MIN  (via drill 0.4)
  Top 0.254: v58.8,50.8 59.08,50.52 91.67,50.52 93.98,48.21 93.98,32.89 91.82,30.73 89.92,30.73 87.63,28.45 v87.63,27.81
  Bottom 0.254: RJ45-Y1.7 35.56,53.34 37.47,51.44 48.26,51.44 RJ45-Y2.7 50.8,53.34 53.34,50.8 v58.8,50.8 | v87.63,27.81 87.5,27.81 86.74,27.05 86.74,22.1 84.45,19.81 84.45,12.83 77.34,5.71 72.64,5.71 71.37,4.45 64.77,4.45 63.66,3.33 YMN.3
YMOT-1  (via drill 0.6)
  Top 0.61: U$5.2B 28.15,80.22 31.11,83.19 31.11,93.34 33.02,95.25 37.47,95.25 v40.64,92.08 | v40.64,78.74 40.64,76.83 41.4,76.07 41.4,58.55 39.62,56.77 39.62,54.61 40.26,53.98 RJ45-Y2.1 43.18,52.7 41.91,51.44 29.84,51.44 27.94,53.34 RJ45-Y1.1
  Bottom 0.61: v40.64,92.08 v40.64,78.74
YMOT-2  (via drill 0.5, 0.6)
  Top 0.61: RJ45-Y1.2 29.21,56.77 30.48,58.04 39.5,58.04 v40.26,58.8 | U$5.2A 28.78,82.76 29.84,83.82 29.84,93.98 32.38,96.52 40.01,96.52 42.55,93.98 v42.55,92.71
  Bottom 0.61: v42.55,92.71 43.18,92.08 43.18,61.85 44.45,60.58 44.45,58.93 | 44.45,58.93 RJ45-Y2.2 | v40.26,58.8 44.32,58.8 44.45,58.93
YMOT-3  (via drill 0.5)
  Top 0.61: RJ45-Y2.4 45.47,58.04 43.43,58.04 41.27,55.88 v40.64,55.88
  Bottom 0.61: U$5.1A 28.78,85.3 31.75,88.27 31.75,93.98 33.02,95.25 41.91,95.25 44.2,92.96 44.2,62.1 46.99,59.31 RJ45-Y2.4 | RJ45-Y1.4 31.75,57.15 32.51,57.91 38.61,57.91 v40.64,55.88
YMOT-4  (via drill 0.5, 0.6)
  Top 0.61: U$5.1B 26.24,87.84 28.57,90.17 28.57,94.61 31.75,97.79 40.64,97.79 44.2,94.23 44.2,91.82 v41.91,89.53 | v41.91,77.47 42.29,77.09 42.29,61.21 42.8,60.71 42.8,58.67 v41.27,57.15 | RJ45-Y1.5 33.02,53.34 33.91,52.45 v41.27,52.45
  Bottom 0.61: v41.91,89.53 v41.91,77.47 | RJ45-Y2.5 48.26,53.34 46.99,52.07 42.29,52.07 41.53,52.83 | v41.27,57.15 41.53,56.9 41.53,52.83 | v41.27,52.45 41.27,52.58 41.53,52.83
Z-MAX
  Top 0.254: RJ45-Z2.8 82.68,56.39
  Bottom 0.254: RJ45-Z1.8 67.31,55.88 67.94,55.24 80.01,55.24 | 80.01,55.24 81.28,55.24 RJ45-Z2.8 | ZMX.3 40.32,4.12 42.55,6.35 70.87,6.35 72.14,7.62 76.71,7.62 82.55,13.46 82.55,20.57 85.09,23.11 85.09,28.19 88.01,31.11 93.98,31.11 96.52,33.66 96.52,41.66 93.34,44.83 93.34,49.53 92.71,50.16 82.55,50.16 80.01,52.7 80.01,55.24
Z-MIN  (via drill 0.4, 0.5)
  Top 0.254: v69.22,52.07 69.85,51.44 80.01,51.44 81.28,52.7 RJ45-Z2.7 | v46.99,17.78 46.99,3.76 ZMN.3
  Bottom 0.254: RJ45-Z2.7 81.28,52.2 82.68,50.8 93.09,50.8 93.98,49.91 93.98,44.96 97.16,41.78 97.16,33.53 94.11,30.48 88.14,30.48 85.72,28.07 85.72,22.99 83.19,20.45 83.19,13.34 76.83,6.99 72.26,6.99 70.99,5.71 49.53,5.71 48.1,4.28 48.1,2.97 ZMN.3 | RJ45-Z1.7 66.04,52.7 66.67,52.07 v69.22,52.07 | RJ45-E3.4 46.99,23.5 48.9,21.59 48.9,19.68 v46.99,17.78
ZMOT-1
  Top 0.61: RJ45-Z1.1 54.36,58.04 46.99,58.04 43.18,61.85 43.18,78.11 41.07,80.22 U$6.2B
  Bottom 0.61: RJ45-Z2.1 73.66,53.34 70.48,50.16 65.41,50.16 63.5,52.07 60.33,52.07 RJ45-Z1.1
ZMOT-2
  Top 0.61: RJ45-Z1.2 57.28,58.93 47.37,58.93 44.2,62.1 44.2,79.38 40.81,82.76 U$6.2A
  Bottom 0.61: RJ45-Z2.2 73.41,58.04 60.58,58.04 59.69,57.15 RJ45-Z1.2
ZMOT-3  (via drill 0.6)
  Top 0.61: RJ45-Z1.4 v59.94,58.8 58.93,59.82 47.88,59.82 45.09,62.61 45.09,80.64 40.43,85.3 U$6.1A
  Bottom 0.61: RJ45-Z2.4 75.06,58.93 60.07,58.93 v59.94,58.8
ZMOT-4
  Top 0.61: 69.22,53.72 69.22,57.15 67.94,58.42 62.87,58.42 60.58,60.71 48.26,60.71 45.97,62.99 45.97,81.92 40.05,87.84 U$6.1B | 69.22,53.72 67.94,52.45 64.39,52.45 63.5,53.34 RJ45-Z1.5 | RJ45-Z2.5 78.74,52.7 78.11,52.07 70.87,52.07 69.22,53.72

### Text on the board
tPlace: X | Y | Z | A | B | C | + | BED PWR | - | EXP1 | EXP2 | Y AXIS | Z AXIS | Z AXIS | E-MOT | X AXIS | Y AXIS | + | - | MAIN PWR | BED THERM | HEATER3 | THERMISTORS | TH_BED | TH_E1 | TH_E2 | TH_E3 | HEATER1 | HEATER2 | PERIPHERAL | MOTOR6 | Z-MAX | Z-MIN | Y-MAX | Y-MIN | X-MAX | X-MIN | + | FET1 | - | + | FET2 | - | + | FET3 | - | + | FET4 | - | SERVO | COR3D CAT5 Shield | for | Cohesion3D ReMix
bPlace: COR3D CAT5 Shield | Designed by Ray Kholodovsky | Manufactured by Cohesion3D
tNames: PWM1